# EasyEDA Pro project ProPrj_智能警报器（终版）_2025-03-04_22-10-02_2025-04-22.epro, schematic Warning_Sent

## Sheets
1 主控: Board Name: 警报发送装置; Create Date: 2025-04-16; Page Name: 主控; Project Name: 智能警报器_2025-03-04_22-10-02; Schematic Name: Warning_Sent; Update Date: 2025-04-21; Company: 嘉立创EDA; Page Size: A4; Version: V1.0
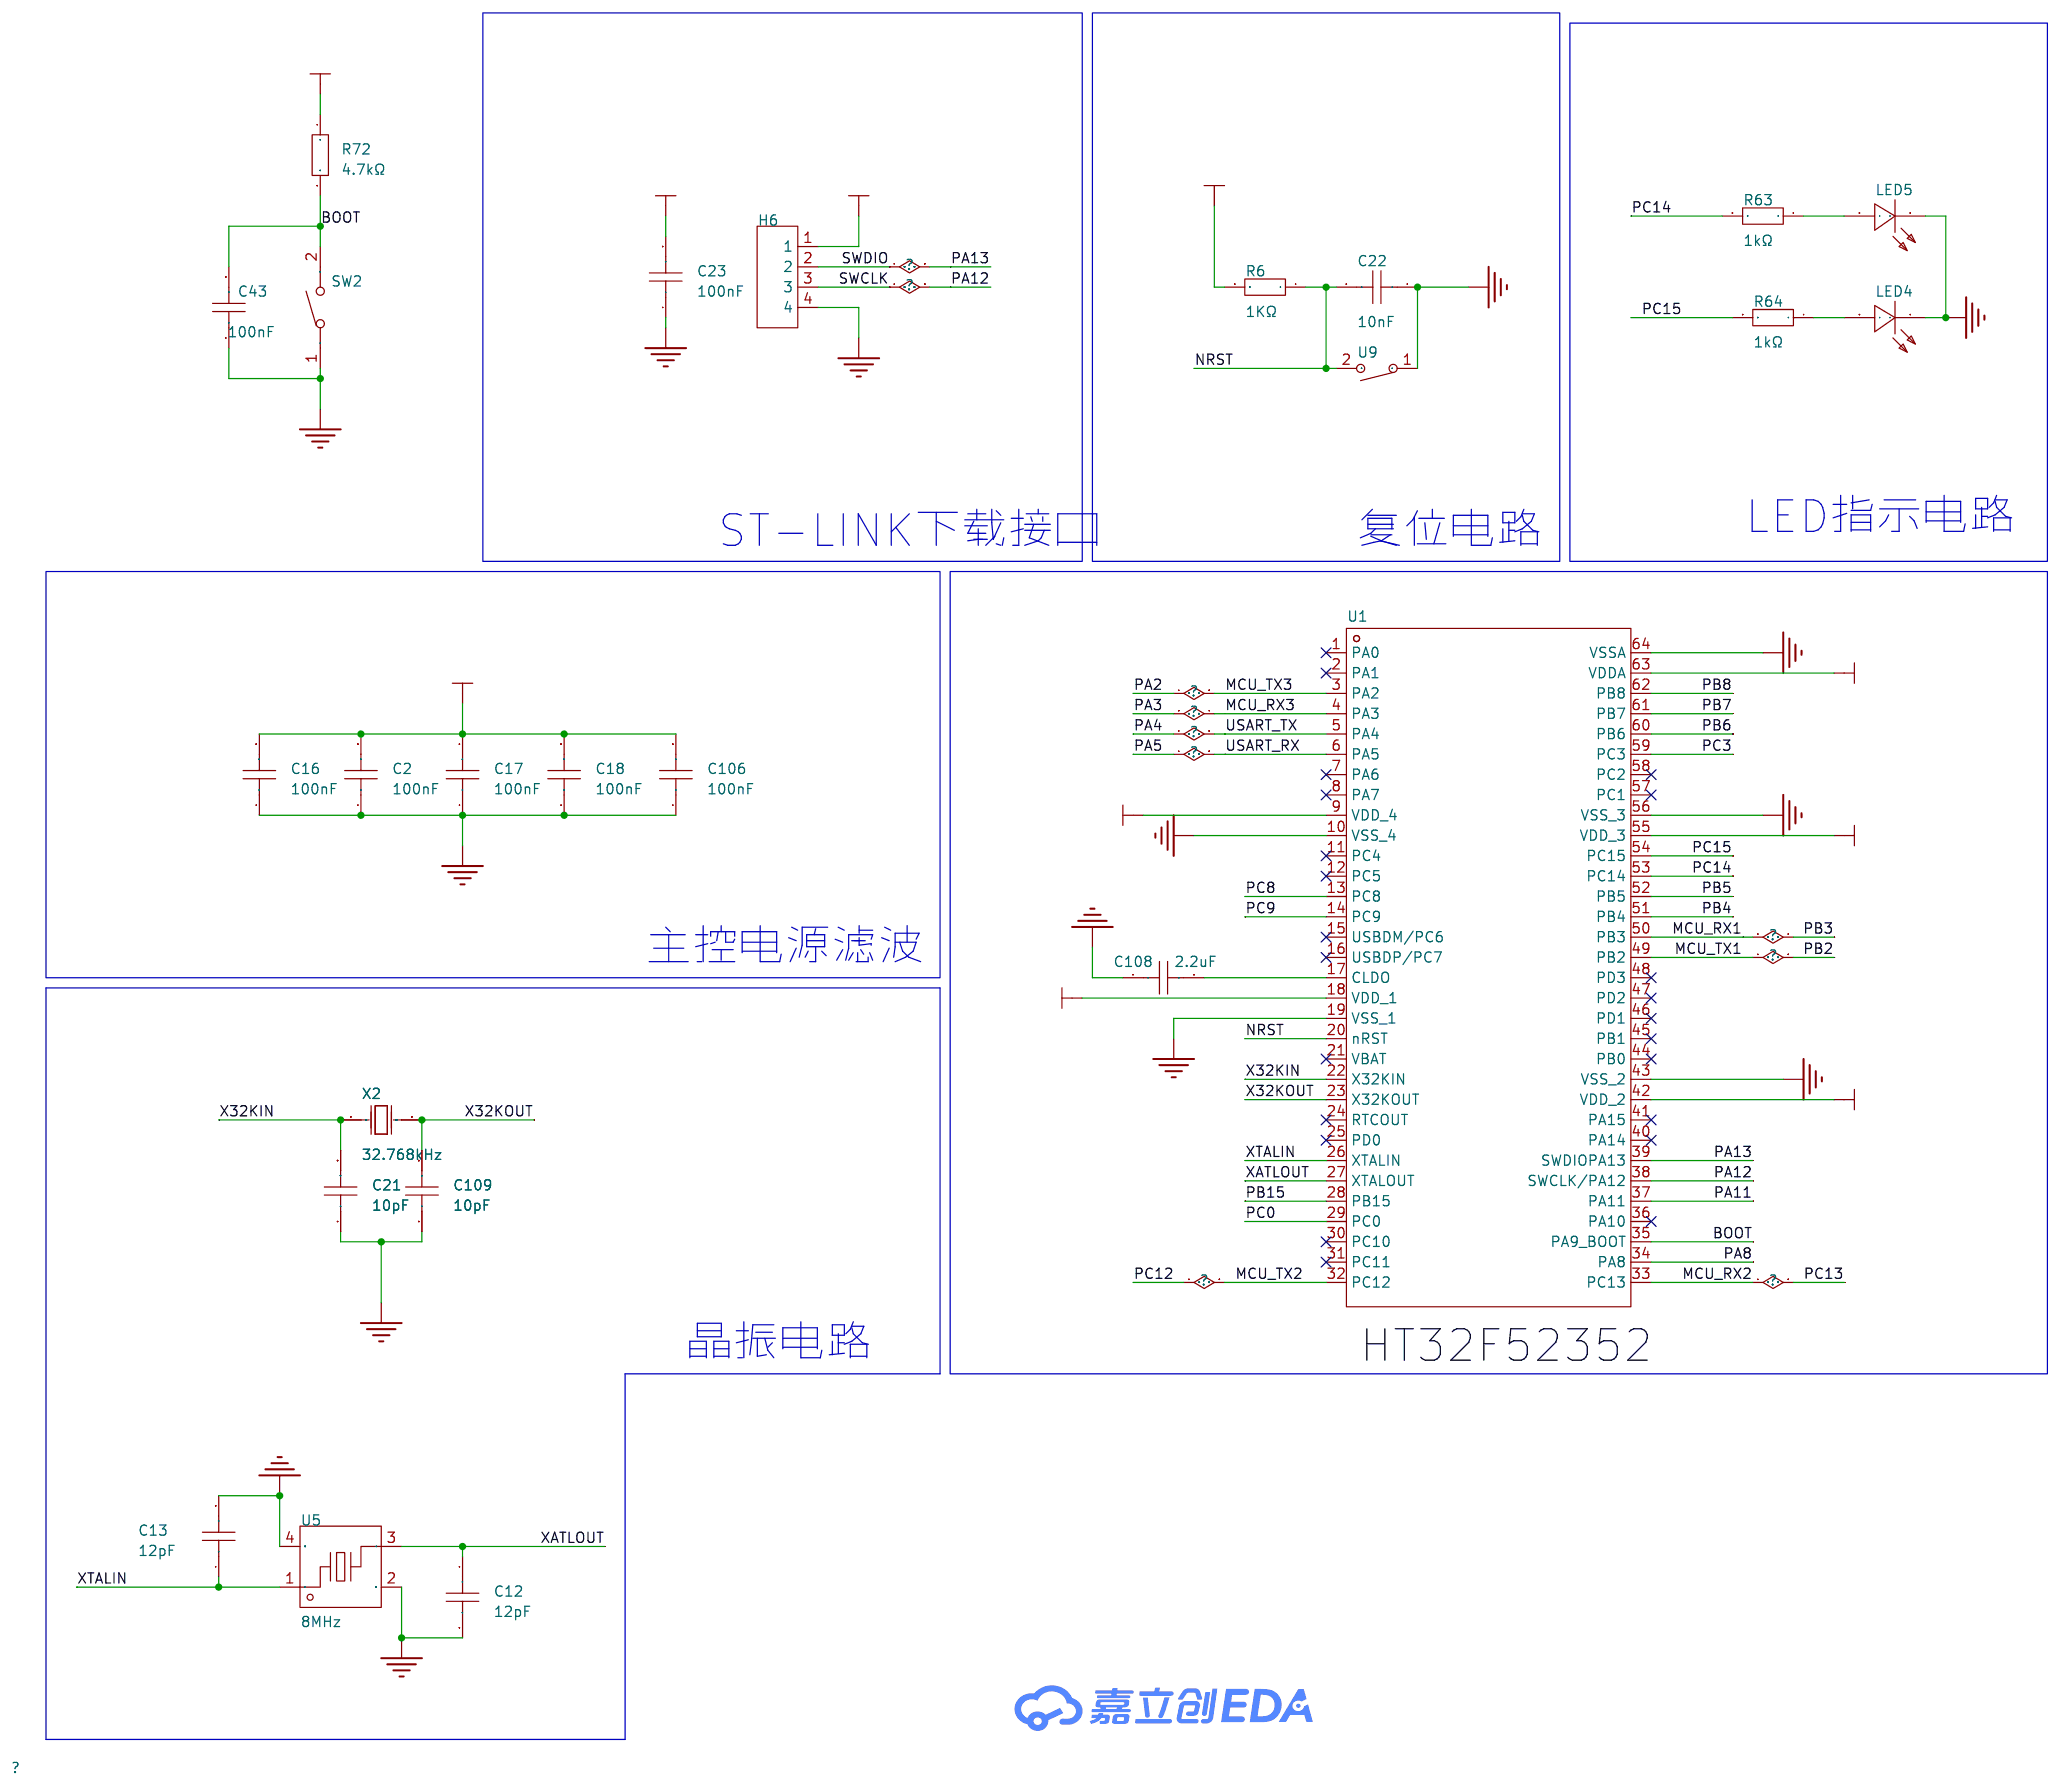
[diagram p9: 主控]
2 电源: Board Name: 检测装置; Create Date: 2025-03-11; Page Name: 电源; Schematic Name: Schematic1; Update Date: 2025-04-03
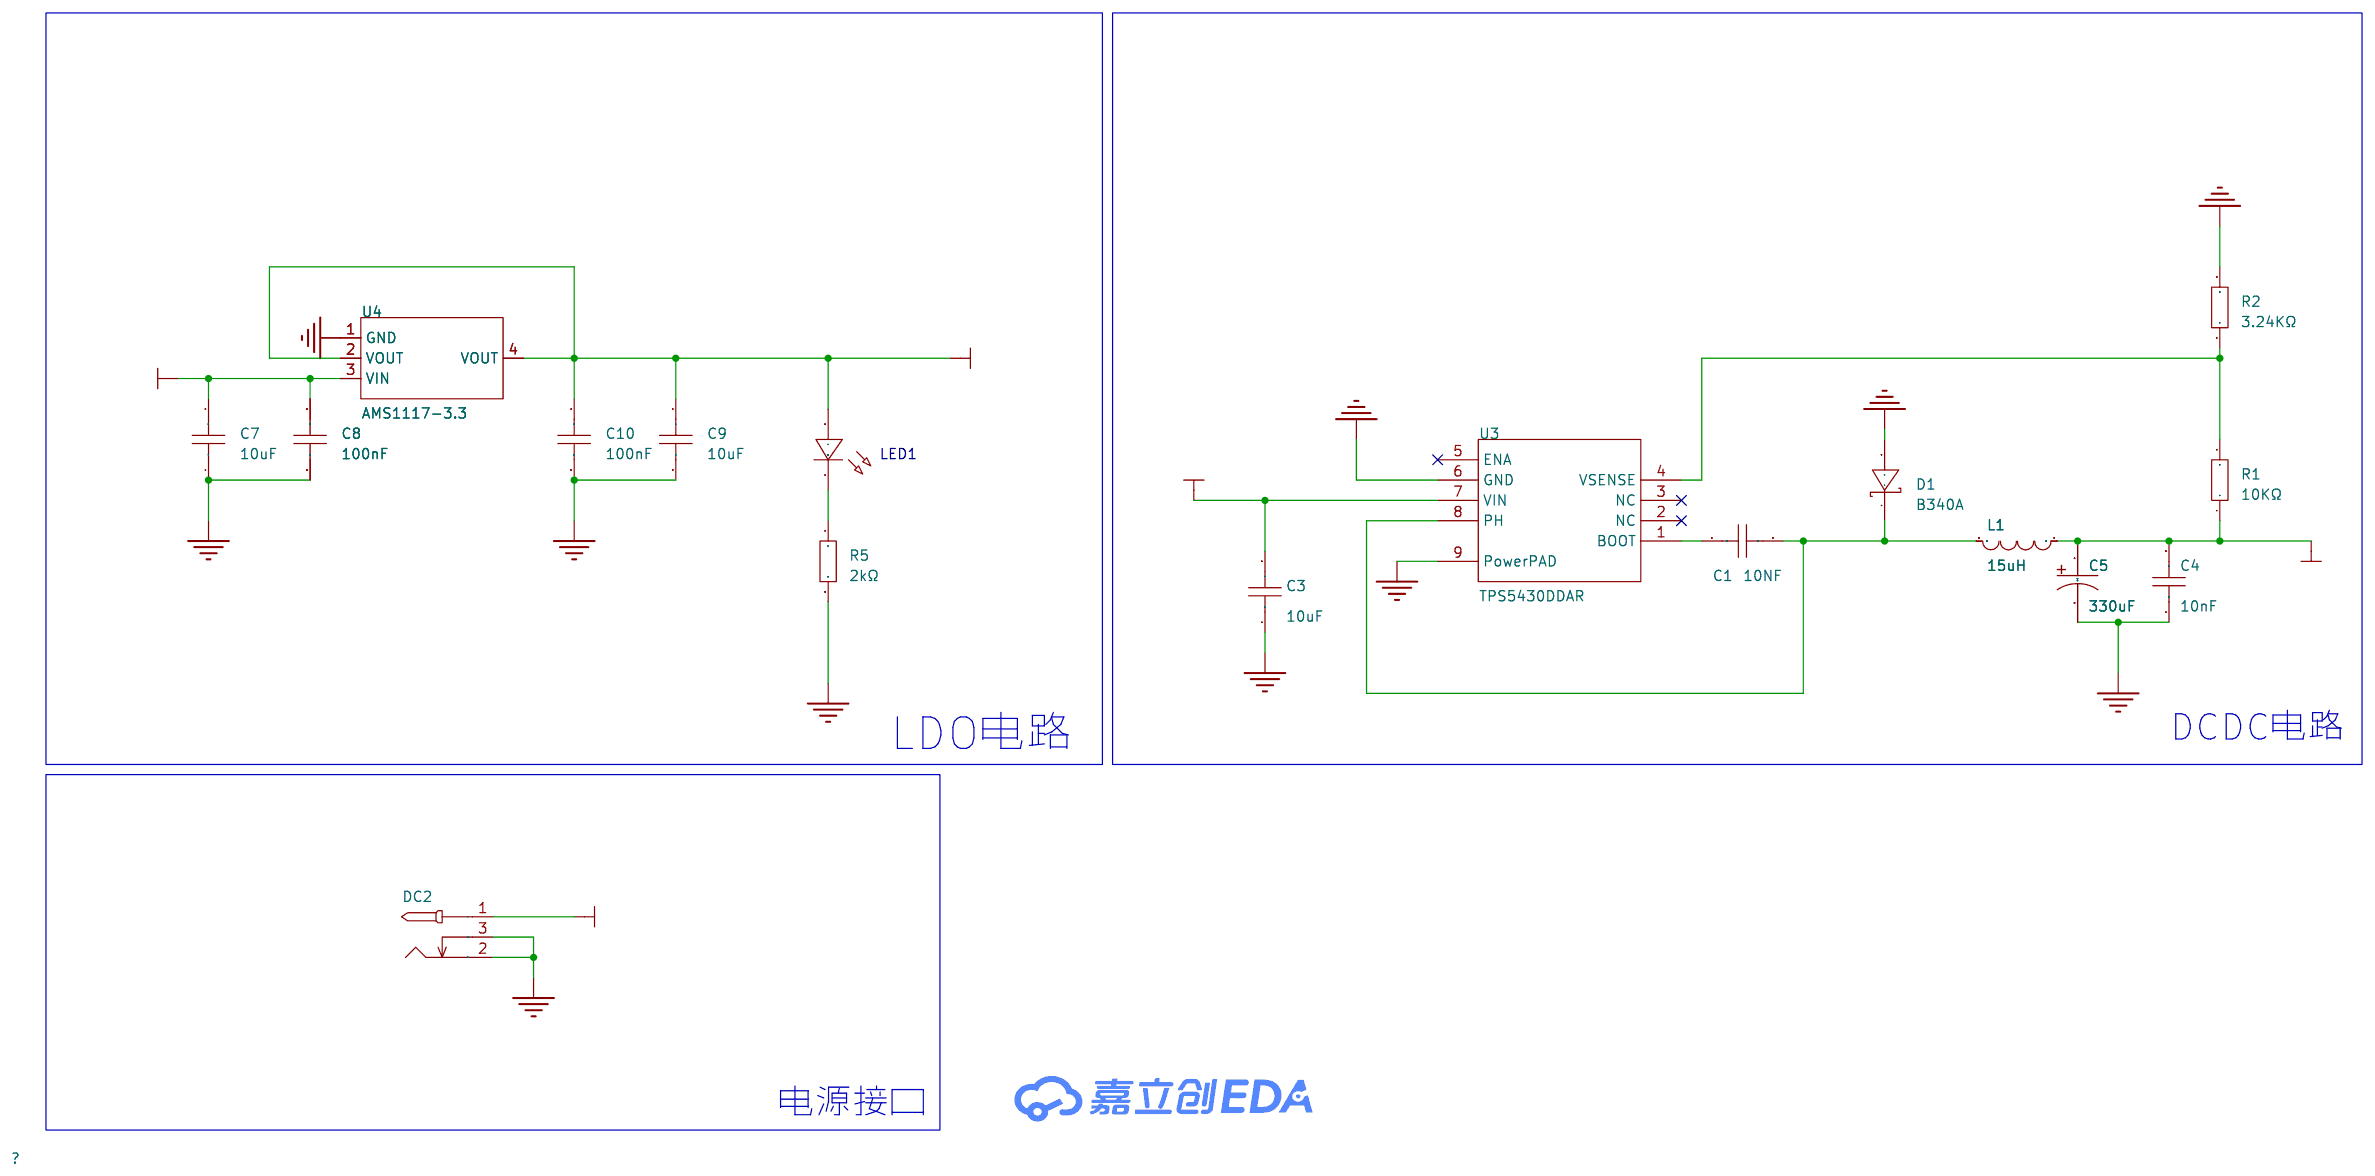
[diagram p10: 电源]
3 模块与接口: Page Name: 模块与接口
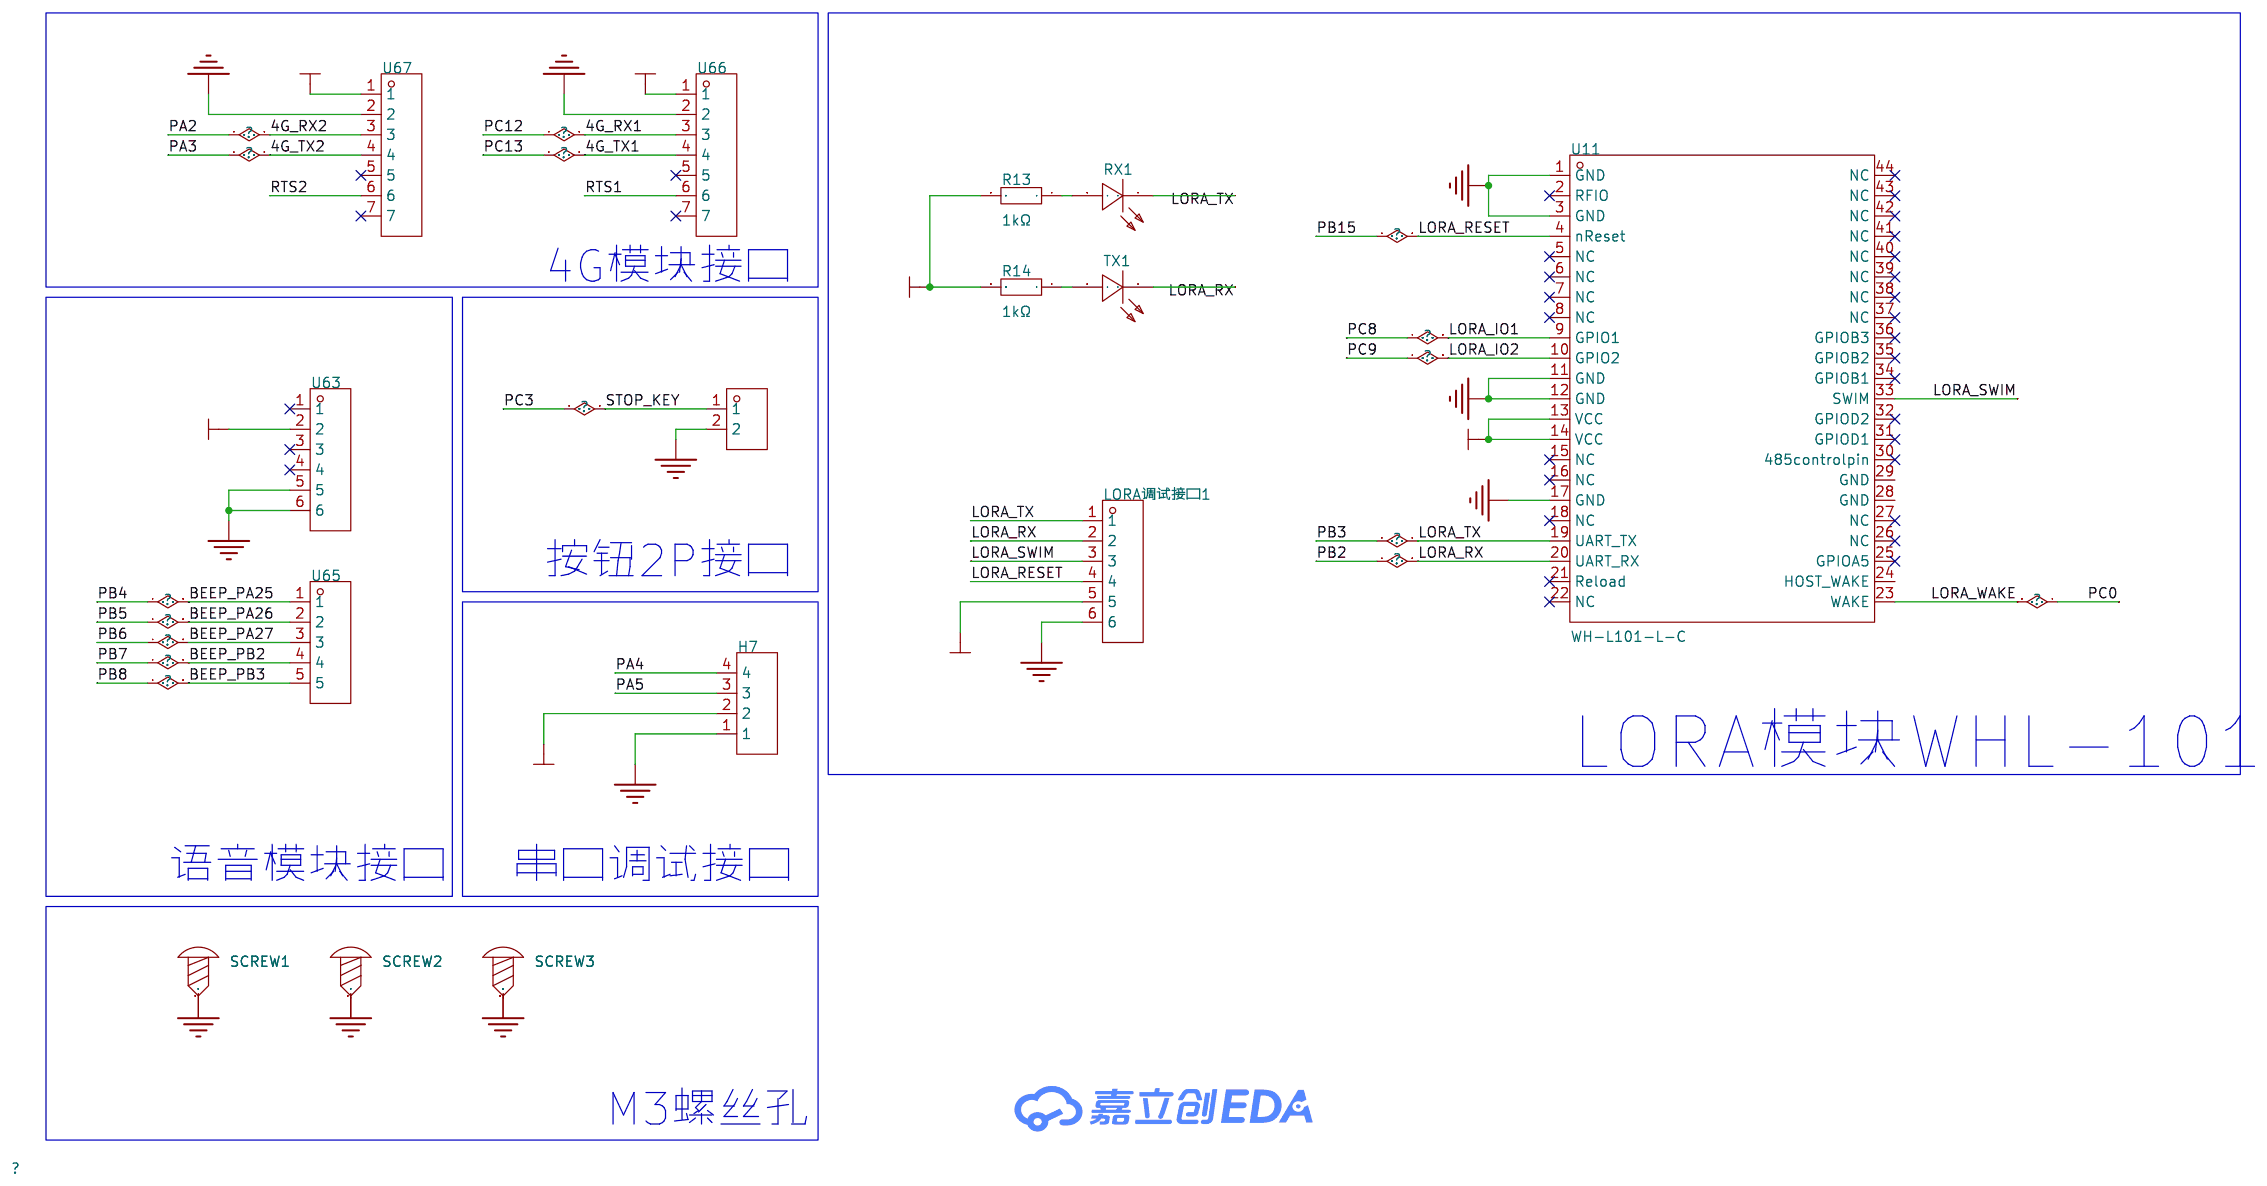
[diagram p11: 模块与接口]

## Parts
sheet 主控
C2  100nF  [C0603]
C12  12pF  [C0603]
C13  12pF  [C0603]
C16  100nF  [C0603]
C17  100nF  [C0603]
C18  100nF  [C0603]
C21  10pF  [C0603]
C22  10nF  [C0603]
C23  100nF  [C0603]
C43  100nF  [C0603]
C106  100nF  [C0603]
C108  2.2uF  [C0603]
C109  10pF  [C0603]
H6  -  [HDR-TH_4P-P2.54-V-M]
LED4  KT-0603R  [LED0603-RD]
LED5  KT-0603R  [LED0603-RD]
R6  1KΩ  [R0603]
R63  1kΩ  [R0603]
R64  1kΩ  [R0603]
R72  4.7kΩ  [R0603]
SW2  TS-1088-AR02016  [SW-SMD_L3.9-W3.0-P4.45]
U1  HT32F52352  [LQFP-64_L7.0-W7.0-P0.40-LS9.2-BL]
U5  8MHz  [CRYSTAL-SMD_4P-L2.5-W2.0-BL]
U9  轻触开关/软触开关(无声)/贴片6*6*5  [SW-SMD_L6.0-W5.9-LS6.6]
X2  32.768kHz  [OSC-SMD_L3.2-W1.5]
sheet 模块与接口
H7  -  [HDR-TH_4P-P2.54-V-M]
LORA调试接口1  PZ254-1-06-Z-2.5-G1  [HDR-TH_6P-P2.54-V-M]
R13  1kΩ  [R0603]
R14  1kΩ  [R0603]
RX1  KT-0603R  [LED0603-RD]
SCREW1  -  [M3螺丝]
SCREW2  -  [M3螺丝]
SCREW3  -  [M3螺丝]
TX1  KT-0603R  [LED0603-RD]
U11  WH-L101-L-C  [COMM-SMD_WH-L101-L-C]
U63  ZX-PM2.54-1-6PY  [HDR-TH_6P-P2.54-V-F]
U65  ZX-PM2.54-1-5PY  [HDR-TH_5P-P2.54-V-F-B]
U66  ZX-XH2.54-7PZZ  [CONN-TH_7P-P2.50_XH2.54MM-7P]
U67  ZX-XH2.54-7PZZ  [CONN-TH_7P-P2.50_XH2.54MM-7P]
按钮2P接口1  ZX-XH2.54-2PZZ  [CONN-TH_2P-P2.50_HX25003-2A]
sheet 电源
C1  10NF  [C0603]
C3  10uF  [C0603]
C4  10nF  [C0603]
C5  330uF  [CAP-SMD_BD5.0-L5.3-W5.3-FD]
C7  10uF  [C0603]
C8  100nF  [C0603]
C9  10uF  [C0603]
C10  100nF  [C0603]
D1  B340A  [SMA_L4.3-W2.6-LS5.1-RD]
DC2  -  [DC-005_2.5]
L1  15uH  [L0603]
LED1  -  [LED_0603]
R1  10KΩ  [R0603]
R2  3.24KΩ  [R0603]
R5  2kΩ  [R0603]
U3  TPS5430DDAR  [ESOP-8_L4.9-W3.9-P1.27-LS6.0-TL-EP]
U4  AMS1117-3.3  [SOT-223-3_L6.5-W3.4-P2.30-LS7.0-BR]

## Library data of the parts
C1-C4 C7-C10 C12 C13 C16-C18 C21-C23 C106 C108 C109 = CAP_0603: Supplier Footprint: 0603
C43 = CC0603KRX7R9BB104: 容值:100nF;精度:±10%;额定电压:50V;材质(温度系数):X7R;; LCSC Part Name: 100nF ±10% 50V; Supplier Part: C14663; Manufacturer: YAGEO(国巨); Supplier Footprint: 0603; JLCPCB Part Class: Basic Part; Datasheet: https://atta.szlcsc.com/upload/public/pdf/source/20180910/C282072_33301C7F631E79921B82A8DAC6BCC5B3.pdf; Supplier: LCSC; Tolerance: ±10%; Voltage Rated: 50V; Temperature Coefficient: X7R
H6 H7 = HDR-M_2.54_1x4P: Supplier Part: C492403; Supplier Footprint: 插件; JLCPCB Part Class: 扩展库
LED4 LED5 RX1 TX1 = KT-0603R: 发光颜色:红色;功率:-;正向电流:-;主波长:-;二极管配置:-;透镜颜色:-;色温:-;发光角度:-;载带方式:-;工作温度:-40℃~+85℃;; LCSC Part Name: 0603 红灯 高亮; Supplier Part: C2286; Manufacturer: KENTO; Supplier Footprint: 0603; JLCPCB Part Class: 基础库; Datasheet: https://atta.szlcsc.com/upload/public/pdf/source/20160616/1466072038404.pdf; Supplier: LCSC; Emitted Color: 红色; Operating Temperature: -40℃~+85℃
R6 = Res_0201: Supplier Footprint: 0201
R13 R14 R63 R64 = RC0603FR-071KL: VCC+5v; LCSC Part Name: 厚膜电阻 1kΩ ±1% 100mW; Supplier Part: C22548; Manufacturer: YAGEO(国巨); Supplier Footprint: 0603; JLCPCB Part Class: Extended Part; Datasheet: https://atta.szlcsc.com/upload/public/pdf/source/20180316/70C0E2BDAE7FCC62C531A5A58D202EE1.pdf; Supplier: LCSC; Type: 厚膜电阻; Tolerance: ±1%; Power(Watts): 100mW; Temperature Coefficient: ±100ppm/℃; Overload Voltage (Max): VCC+5v; Operating Temperature Range: -55℃~+155℃
R72 = RC0603FR-074K7L: 电阻类型:厚膜电阻;阻值:4.7kΩ;精度:±1%;功率:100mW;最大工作电压:75V;温度系数:±100ppm/℃;; LCSC Part Name: 厚膜电阻 4.7kΩ ±1% 100mW; Supplier Part: C99782; Manufacturer: YAGEO(国巨); Supplier Footprint: 0603; JLCPCB Part Class: 扩展库; Datasheet: https://atta.szlcsc.com/upload/public/pdf/source/20180224/C181757_15194369480721363983.pdf; Supplier: LCSC; Type: 厚膜电阻; Tolerance: ±1%; Power(Watts): 100mW; Overload Voltage (Max): 75V; Temperature Coefficient: ±100ppm/℃; Operating Temperature Range: -55℃~+155℃
SW2 = TS-1088-AR02016: 触点电流:50mA;额定电压(DC):12V;绝缘电阻:100MΩ;电路结构:单刀单掷;安装方式:立贴;作用力:160gf@±50gf;机械寿命:10万次;带支架:否;; LCSC Part Name: 4*3*2mm 立贴 轻触开关; Supplier Part: C720477; Manufacturer: XUNPU(讯普); Supplier Footprint: SMD; JLCPCB Part Class: 扩展库; Datasheet: https://atta.szlcsc.com/upload/public/pdf/source/20200810/C720475_60D09DD6C54279ADDB2DC25100F1CC11.pdf; Supplier: LCSC; Contact Current: 50mA; Voltage Rating (DC): 12V; Insulation Resistance: 100MΩ; Circuit: 单刀单掷; Mounting Style: 立贴; Actuator Style: 圆形按钮; Actuator/Cap Color: 黑色; Operating Force: 160gf@±50gf; Mechanical Life: 10万次; Operating Temperature: -30℃~+80℃; Pin Style: SMD接片; Switch Length: 4mm; Switch Width: 3mm; Switch Height: 2mm; Strike Gundam: 否
U1 = HT32F52352: CPU内核:CM0;程序存储容量:128KB;RAM总容量:16KB;GPIO端口数量:51;工作电压范围:2V~3.6V;CPU最大主频:48MHz;程序存储器类型:FLASH;; Supplier Part: C97188; Manufacturer: HOLTEK(合泰/盛群); Supplier Footprint: LQFP-64(7x7); JLCPCB Part Class: 扩展库; Datasheet: https://atta.szlcsc.com/upload/public/pdf/source/20231226/5DA994CBD2B5E793EB1549DB6E6CD66A.pdf; Supplier: LCSC; CPU Core: CM0; Program Storage Size: 128KB; RAM Size: 16KB; GPIO Ports Number: 51; Operating Voltage Range: 2V~3.6V; CPU Maximum Speed: 48MHz; Program Memory Type: FLASH; Operating Temperature Range: -40℃~+85℃; ADC (Bit): 12bit; 16Bit Timer: 5; 32Bit Timer: 2; UART/USART: 4; I2C: 2; I2S: 1; SPI: 2; Universal Serial Bus: 有; Internal Comparator: 有; Peripheral/Function: 低电压检测；看门狗；CCP捕获/比较；乘法器；IrDA；CRC校验；DMA；RTC实时时钟; Watchdog: 有; Real-Time Clock: 有; Infrared Data Association: 有; Low-Voltage Detect: 有; CCP Capture/Compare: 有; Direct Memory Access: 有; Internal Oscillator: 有
U5 = SX2B50.000F1010F30: 晶振类型:贴片晶振;频率:50MHz;常温频差:±10ppm;外接负载电容:10pF;频率稳定度(全温):±30ppm;; LCSC Part Name: 50MHz ±10ppm 10pF; Supplier Part: C7301998; Manufacturer: SCTF(星通时频); Supplier Footprint: SMD2520-4P; JLCPCB Part Class: 扩展库; Datasheet: https://atta.szlcsc.com/upload/public/pdf/source/20230613/6EDA3BD8336403B8AE72C3A173CC38D7.pdf; Supplier: LCSC; Crystal Type: 贴片晶振; Normal temperature Frequency Tolerance: ±10ppm; External load capacitor: 10pF; Frequency Stability(Full temperature range): ±30ppm; Equivalent Series Resistance (ESR): 40Ω; Operating Temperature: -40℃~+85℃
U9 = 轻触开关/软触开关(无声)/贴片6*6*5_C9900014294: Supplier Part: C9900014294; JLCPCB Part Class: 扩展库; Supplier: LCSC
X2 = SF32WK32768D31T002: 晶振类型:-;频率:-;外接负载电容:-;; LCSC Part Name: 3215  32.768KHZ  12.5PF  ±20PPM  -40℃~+85℃; Supplier Part: C271654; Manufacturer: TKD(泰晶); Supplier Footprint: SMD3215-2P; JLCPCB Part Class: 扩展库; Datasheet: https://atta.szlcsc.com/upload/public/pdf/source/20210414/C271654_9FD726E46D0A9E6DACC0E569C8E3A63B.pdf; Supplier: LCSC
LORA调试接口1 = PZ254-1-06-Z-2.5-G1: 插针结构:1x6P;间距:2.54mm;行距:-;圆针/方针:方针;安装类型:直插;排数:单排;总PIN位数:6P;额定电流:3A;配合针长度:6mm;塑高:2.5mm;端接针长度:3mm;触头材质:黄铜;工作温度范围:-40℃~+105℃;焊接温度(最大值):260℃@10S;颜色:黑色;; LCSC Part Name: 1x6P 间距:2.54mm 方针 直插; Supplier Part: C18197913; Manufacturer: HCTL(华灿天禄); Supplier Footprint: 插件,P=2.54mm; Datasheet: https://atta.szlcsc.com/upload/public/pdf/source/20230921/1753130D8F97492C8335A75164C0C73A.pdf; Supplier: LCSC; Pin Structure: 1x6P; Pitch: 2.54mm; Circluar Pins/Square Pins: 方针; Mounting Type: 直插; Number of Rows: 单排; Number of Pins: 6P; Current Rating (Max): 3A; Length of Mating Pin: 6mm; Insulation Height: 2.5mm; Length of End Connection Pin: 3mm; Contact Material: 黄铜; Operating Temperature Range: -40℃~+105℃; Soldering Temperature(Max): 260℃@10S; Color: 黑色
SCREW1-SCREW3 = M3螺丝: Supplier Footprint: 插件
U11 = WH-L101-L-C: Supplier Part: C2839188; Manufacturer: USR(有人物联网); Supplier Footprint: SMD,18.2x26.7mm; JLCPCB Part Class: 扩展库; Datasheet: https://atta.szlcsc.com/upload/public/pdf/source/20210707/C2839188_8B9CF052393124210560C9EDFDE3EF54.pdf; Supplier: LCSC
U63 = ZX-PM2.54-1-6PY: 插孔结构:1x6P;间距:2.54mm;行距:-;圆孔/方孔:方孔;安装类型:直插;排数:单排;总孔位数:6P;额定电流:-;额定电压:1kV;插孔方向:顶部;塑高:8.5mm;触头材质:-;触头镀层:金;工作温度范围:-40℃~+105℃;; LCSC Part Name: 1x6P 间距:2.54mm 直插; Supplier Part: C7499326; Manufacturer: Megastar(兆星); Supplier Footprint: 插件,P=2.54mm; JLCPCB Part Class: 扩展库; Datasheet: https://atta.szlcsc.com/upload/public/pdf/source/20231122/5093CF5A271587A70D4E81169F87FBCD.pdf; Supplier: LCSC; Holes Structure: 1x6P; Pitch: 2.54mm; Circular Hole / Square Hole: 方孔; Mounting Type: 直插; Number of Rows: 单排; Number of Holes: 6P; Voltage Rating (Max): 1kV; Holes Direction: 顶部; Insulation Height: 8.5mm; Contact Plating: 金; Operating Temperature Range: -40℃~+105℃
U65 = ZX-PM2.54-1-5PY: 插孔结构:1x5P;间距:2.54mm;行距:-;圆孔/方孔:方孔;安装类型:直插;排数:单排;总孔位数:5P;额定电流:-;额定电压:1kV;插孔方向:顶部;塑高:8.5mm;触头材质:-;触头镀层:金;工作温度范围:-40℃~+105℃;焊接温度(最大值):260℃@5S;; LCSC Part Name: 1x5P 间距:2.54mm 直插; Supplier Part: C7499325; Manufacturer: Megastar(兆星); Supplier Footprint: 插件,P=2.54mm; JLCPCB Part Class: 扩展库; Datasheet: https://atta.szlcsc.com/upload/public/pdf/source/20231122/01AD59B2A60BC9F43EFC39D61657673E.pdf; Supplier: LCSC; Holes Structure: 1x5P; Pitch: 2.54mm; Circular Hole / Square Hole: 方孔; Mounting Type: 直插; Number of Rows: 单排; Number of Holes: 5P; Voltage Rating (Max): 1kV; Holes Direction: 顶部; Insulation Height: 8.5mm; Contact Plating: 金; Operating Temperature Range: -40℃~+105℃; Soldering Temperature(Max): 260℃@5S
U66 U67 = ZX-XH2.54-7PZZ: 插针结构:1x7P;间距:2.5mm;安装方式:直插;参考系列:XH;总PIN数:7P;排数:1;每排PIN数:7;行距:-;额定电流:3A;触头材质:黄铜;触头镀层:锡;工作温度范围:-25℃~+85℃;; LCSC Part Name: 1x7P 间距:2.5mm 直插 系列:XH; Supplier Part: C7429637; Manufacturer: Megastar(兆星); Supplier Footprint: 插件,P=2.5mm; JLCPCB Part Class: 扩展库; Datasheet: https://atta.szlcsc.com/upload/public/pdf/source/20230619/EB8CD154C1DA3F5B1470298D84E36C50.pdf; Supplier: LCSC; Pins Structure: 1x7P; Pitch: 2.5mm; Mounting Type: 直插; Reference Series: XH; Number of Pins: 7P; Number of Rows: 1; Number of PINs Per Row: 7; Rated Current: 3A; Contact Material: 黄铜; Contact Plating: 锡; Operating Temperature: -25℃~+85℃; Rated Voltage (Max): 250V; Plastic Material: PA66; Flame Retardant Rating: UL94V-0; Color: 白色; Z-Height of the Board: 7mm; X-Length of Bottom Edge on Board (Spacing Line): 20mm; Y-Width of Bottom Edge on Board: 5.9mm
按钮2P接口1 = ZX-XH2.54-2PZZ: 插针结构:1x2P;间距:2.54mm;安装方式:直插;参考系列:XH;总PIN数:2P;排数:1;每排PIN数:2;行距:-;额定电流:3A;触头材质:黄铜;触头镀层:锡;工作温度范围:-25℃~+85℃;; Supplier Part: C7429632; Manufacturer: Megastar(兆星); Supplier Footprint: 插件,P=2.54mm; Datasheet: https://atta.szlcsc.com/upload/public/pdf/source/20230619/19BA6947230AA44A04D3EDD65E618FD0.pdf; Supplier: LCSC; Pins Structure: 1x2P; Pitch: 2.54mm; Mounting Style: 直插; Reference Series: XH; Number of Pins: 2P; Number of Rows: 1; Number of PINs Per Row: 2; Current Rating (Max): 3A; Contact Material: 黄铜; Contact Plating: 锡; Operating Temperature Range: -25℃~+85℃
C5 = EMVE500ADA4R7ME55G: 容值:4.7uF;精度:±20%;额定电压:50V;纹波电流:20mA@120Hz;等效串联电阻:-;; LCSC Part Name: 4.7uF ±20% 50V; Supplier Part: C178270; Manufacturer: NCC(日本贵弥功); Supplier Footprint: SMD,D5xL5.2mm; JLCPCB Part Class: 扩展库; Datasheet: https://atta.szlcsc.com/upload/public/pdf/source/20180530/C178280_3EF6968EAC9B0F0D2B2AB76FB03ACC1C.pdf; Supplier: LCSC; Tolerance: ±20%; Rated Voltage: 50V; Ripple Current: 20mA@120Hz; φD: 5mm; L: 5.2mm; Lifetime @ Temp: 1000hrs@105℃; Operating Temperature: -40℃~+105℃
D1 = B340A: 二极管配置:独立式;正向压降(Vf):550mV@3A;直流反向耐压(Vr):40V;整流电流:3A;; LCSC Part Name: 电压:40V 电流:3A; Supplier Part: C64982; Manufacturer: MDD(辰达半导体); Supplier Footprint: SMA(DO-214AC); JLCPCB Part Class: 扩展库; Datasheet: https://atta.szlcsc.com/upload/public/pdf/source/20240710/591710C3B34CDB7FE3DA92C119E6F598.pdf; Supplier: LCSC; Diode Configuration: 独立式; Forward Voltage (Vf@If): 550mV@3A; Reverse Voltage (Vr): 40V; Rectified Current: 3A; Reverse Leakage Current (Ir): 500uA@40V
DC2 = DC-005_2.5: Supplier Footprint: 插件
L1 = L_0603
LED1 = LED_0603-G: Supplier Footprint: 0603
R1 R2 R5 = Res_0603: Supplier Footprint: 0603
U3 = TPS5430DDAR: 功能类型:降压型;输出类型:可调;工作电压:5.5V~36V;输出电压:1.221V~32.04V;输出电流:3A;; LCSC Part Name: 宽输入范围、3A输出电流的降压转换器; Supplier Part: C9864; Manufacturer: TI(德州仪器); Supplier Footprint: SOIC-8-EP; JLCPCB Part Class: 基础库; Datasheet: https://www.ti.com/cn/lit/gpn/tps5430; Supplier: LCSC; Function: 降压型; Output Type: 可调; Input Voltage: 5.5V~36V; Output Voltage: 1.221V~32.04V; Output Current: 3A; Switching Frequency: 500kHz; Operating Temperature: -40℃~+125℃@(TJ); Synchronous Rectification: 否; Number of Outputs: 1; Topology: 降压式; Switch tube (built-in/external): 内置
U4 = AMS1117-3.3_C6186: 输出类型:固定;工作电压:-;输出电压:3.3V;输出电流:1A;电源纹波抑制比(PSRR):72dB@(120Hz);输出极性:正极;; LCSC Part Name: 输出3.3V 1A; Supplier Part: C6186; Manufacturer: AMS; Supplier Footprint: SOT-223; JLCPCB Part Class: 基础库; Datasheet: https://atta.szlcsc.com/upload/public/pdf/source/20180727/C6186_7A095716F0823C02F1997A905E26C086.pdf; Supplier: LCSC; Output Type: 固定; Output Voltage: 3.3V; Output Current: 1A; Power Supply Rejection Ratio (PSRR): 72dB@(120Hz); Voltage Dropout: 1.3V@(800mA); Features: 过流保护(OCP)；热关断(TSD); Output Configuration: 正极; Number of Outputs: 1

## Nets
GND: C2.1 C3.1 C4.1 C5.2 C7.1 C8.1 C9.2 C10.2 C12.2 C13.2 C16.1 C17.1 C18.1 C21.1 C22.1 C23.1 C43.1 C106.1 C108.1 C109.1 D1.2(A) DC2.2 DC2.3 H6.4 H7.1 LED4.1(K) LED5.1(K) LORA调试接口1.6 R2.2 R5.2 SCREW1.1 SCREW2.1 SCREW3.1 SW2.1 U1.10(VSS_4) U1.19(VSS_1) U1.43(VSS_2) U1.56(VSS_3) U1.64(VSSA) U3.6(GND) U3.9(PowerPAD) U4.1(GND) U5.2(GND) U5.4(GND) U9.1 U11.1(GND) U11.3(GND) U11.11(GND) U11.12(GND) U11.17(GND) U63.5 U63.6 U66.2 U67.2 按钮2P接口1.2
VCC+3.3V: C2.2 C9.1 C10.1 C16.2 C17.2 C18.2 C23.2 C106.2 H6.1 H7.2 LED1.2(A) LORA调试接口1.5 R6.2 R13.2 R14.2 R72.1 U1.9(VDD_4) U1.18(VDD_1) U1.42(VDD_2) U1.55(VDD_3) U1.63(VDDA) U4.2(VOUT) U4.4(VOUT) U11.13(VCC) U11.14(VCC)
VCC+5V: C4.2 C5.1 C7.2 C8.2 L1.1 R1.1 U4.3(VIN) U63.2
VCC_IN: C3.2 DC2.1(4) U3.7(VIN) U66.1 U67.1
4G_RX1: U1.32(PC12) U66.3
4G_RX2: U1.3(PA2) U67.3
4G_TX1: U1.33(PC13) U66.4
4G_TX2: U1.4(PA3) U67.4
BEEP_PA25: U1.51(PB4) U65.1
BEEP_PA26: U1.52(PB5) U65.2
BEEP_PA27: U1.60(PB6) U65.3
BEEP_PB2: U1.61(PB7) U65.4
BEEP_PB3: U1.62(PB8) U65.5
BOOT: C43.2 R72.2 SW2.2 U1.35(PA9_BOOT)
LORA_IO1: U1.13(PC8) U11.9(GPIO1)
LORA_IO2: U1.14(PC9) U11.10(GPIO2)
LORA_RESET: LORA调试接口1.4 U1.28(PB15) U11.4(nReset)
LORA_RX: LORA调试接口1.2 TX1.1(K) U1.49(PB2) U11.20(UART_RX)
LORA_SWIM: LORA调试接口1.3 U11.33(SWIM)
LORA_TX: LORA调试接口1.1 RX1.1(K) U1.50(PB3) U11.19(UART_TX)
LORA_WAKE: U1.29(PC0) U11.23(WAKE)
NRST: C22.2 R6.1 U1.20(nRST) U9.2
PA4: H7.4 U1.5(PA4)
PA5: H7.3 U1.6(PA5)
PA8: U1.34(PA8)
PA11: U1.37(PA11)
PA12: H6.3 U1.38(SWCLK/PA12)
PA13: H6.2 U1.39(SWDIOPA13)
PC3: U1.59(PC3) 按钮2P接口1.1
PC14: R63.2 U1.53(PC14)
PC15: R64.2 U1.54(PC15)
RTS1: U66.6
RTS2: U67.6
X32KIN: C21.2 U1.22(X32KIN) X2.1(OSC1)
X32KOUT: C109.2 U1.23(X32KOUT) X2.2(OSC2)
XATLOUT: C12.1 U1.27(XTALOUT) U5.3
XTALIN: C13.1 U1.26(XTALIN) U5.1
$2N8921: C108.2 U1.17(CLDO)
$2N22907: LED4.2(A) R64.1
$2N22912: LED5.2(A) R63.1
$3N414: C1.2 D1.1(K) L1.2 U3.8(PH)
$3N415: C1.1 U3.1(BOOT)
$3N416: R1.2 R2.1 U3.4(VSENSE)
$3N4500: LED1.1(C) R5.1
$4N844: R13.1 RX1.2(A)
$4N845: R14.1 TX1.2(A)

Not connected (* = marked no-connect by the designer): U1 1(PA0)* 2(PA1)* 7(PA6)* 8(PA7)* 11(PC4)* 12(PC5)* 15(USBDM/PC6)* 16(USBDP/PC7)* 21(VBAT)* 24(RTCOUT)* 25(PD0)* 30(PC10)* 31(PC11)* 36(PA10)* 40(PA14)* 41(PA15)* 44(PB0)* 45(PB1)* 46(PD1)* 47(PD2)* 48(PD3)* 57(PC1)* 58(PC2)*; U3 2(NC)* 3(NC)* 5(ENA)*; U11 2(RFIO)* 5(NC)* 6(NC)* 7(NC)* 8(NC)* 15(NC)* 16(NC)* 18(NC)* 21(Reload)* 22(NC)* 24(HOST_WAKE) 25(GPIOA5)* 26(NC)* 27(NC)* 28(GND) 29(GND) 30(485controlpin)* 31(GPIOD1)* 32(GPIOD2)* 34(GPIOB1)* 35(GPIOB2)* 36(GPIOB3)* 37(NC)* 38(NC)* 39(NC)* 40(NC)* 41(NC)* 42(NC)* 43(NC)* 44(NC)*; U63 1* 3* 4*; U66 5* 7*; U67 5* 7*

## Notes on the sheets
sheet 1
- LED指示电路
- ST-LINK下载接口
- 复位电路
- 主控电源滤波
- 晶振电路
sheet 2
- DCDC电路
- LDO电路
- 电源接口
sheet 3
- 4G模块接口
- 按钮2P接口
- LORA模块WHL-101
- 语音模块接口
- 串口调试接口
- M3螺丝孔
